# Altium schematic sheet SerialConverter.SchDoc
size A; SheetNumber: 3; SheetTotal: 6
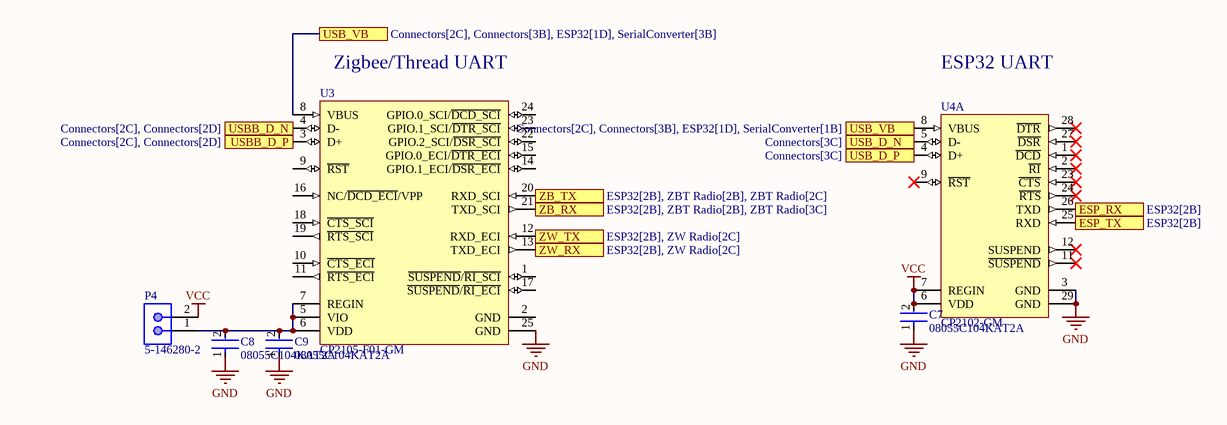
[diagram p0: SerialConverter.SchDoc]

## Parts
C7  08055C104KAT2A  [FP-0805-L_2_01_0_2-W_1_25-IPC_C]
C8  08055C104KAT2A  [FP-0805-L_2_01_0_2-W_1_25-IPC_C]
C9  08055C104KAT2A  [FP-0805-L_2_01_0_2-W_1_25-IPC_C]
P4  5-146280-2  [TECO-5-146280-2_V]
U3  CP2105-F01-GM  [SLAB-QFN-24-2675x2675TP_N]
U4  CP2102-GM  [SLAB-QFN-28-3125x3125TP_N]  (part A of 2)

## Ports
ESP_RX (out, see ESP32[2B]), ESP_TX (in, see ESP32[2B]), USB_D_N (see Connectors[3C]), USB_D_P (see Connectors[3C]), USB_VB (see Connectors[2C], Connectors[3B], ESP32[1D], SerialConverter[1B]), USB_VB (see Connectors[2C], Connectors[3B], ESP32[1D], SerialConverter[3B]), USBB_D_N (see Connectors[2C], Connectors[2D]), USBB_D_P (see Connectors[2C], Connectors[2D]), ZB_RX (out, see ESP32[2B], ZBT Radio[2B], ZBT Radio[3C]), ZB_TX (in, see ESP32[2B], ZBT Radio[2B], ZBT Radio[2C]), ZW_RX (out, see ESP32[2B], ZW Radio[2C]), ZW_TX (in, see ESP32[2B], ZW Radio[2C])

## Nets
GND: C7.1 C8.1 C9.1 U3.25(GND) U4.3(GND) U4.29(GND)
VCC: C7.2 P4.2 U4.6(VDD) U4.7(REGIN)
ESP_RX: U4.26(TXD) ; port ESP_RX
ESP_TX: U4.25(RXD) ; port ESP_TX
USB_D_N: U4.5(D-) ; port USB_D_N
USB_D_P: U4.4(D+) ; port USB_D_P
USB_VB: U3.8(VBUS) U4.8(VBUS) ; port USB_VB
USBB_D_N: U3.4(D-) ; port USBB_D_N
USBB_D_P: U3.3(D+) ; port USBB_D_P
ZB_RX: U3.21(TXD_SCI) ; port ZB_RX
ZB_TX: U3.20(RXD_SCI) ; port ZB_TX
ZW_RX: U3.13(TXD_ECI) ; port ZW_RX
ZW_TX: U3.12(RXD_ECI) ; port ZW_TX
NetC8_2: C8.2 C9.2 P4.1 U3.5(VIO) U3.6(VDD) U3.7(REGIN)

Not connected (* = marked no-connect by the designer): U3 1(~{SUSPEND}/~{RI_SCI}) 2(GND) 9(~{RST}) 10(~{CTS_ECI}) 11(~{RTS_ECI}) 14(GPIO.1_ECI/~{DSR_ECI}) 15(GPIO.0_ECI/~{DTR_ECI}) 16(NC/~{DCD_ECI}/VPP) 17(~{SUSPEND}/~{RI_ECI}) 18(~{CTS_SCI}) 19(~{RTS_SCI}) 22(GPIO.2_SCI/~{DSR_SCI}) 23(GPIO.1_SCI/~{DTR_SCI}) 24(GPIO.0_SCI/~{DCD_SCI}); U4 1(~{DCD})* 2(~{RI})* 9(~{RST})* 11(~{SUSPEND})* 12(SUSPEND)* 23(~{CTS})* 24(~{RTS})* 27(~{DSR})* 28(~{DTR})*

## Notes on the sheet
- (near U3) Zigbee/Thread UART
- ESP32 UART

## Library data of the parts
C7-C9 = CMP-2000-05016-2: General Purpose Ceramic Capacitor, 0805, 100nF, 10%, X7R, 0.15, 50V; Dissipation Factor: 2.5%; Insulation Resistance: 100GR; Voltage Rating (DC): 50V; Package Quantity: 4000; Tolerance: 10%; Voltage Rating: 50V; Dielectric: X7R; Case/Package: 0805; Lead Free: Lead Free; Dielectric Material: Ceramic; Thickness: 0.037inch; Weight: 0.001411oz; Max Operating Temperature: 125°C; REACH SVHC: No SVHC; Mount: Surface Mount; RoHS Compliant: Yes; Depth: 1.25mm; Height: 0.5mm; Case Code (Metric): 2012; Length: 2mm; Termination: Standard; Case Code (Imperial): 0805; Number of Pins: 2; Voltage: 50V; Radiation Hardening: No; Min Operating Temperature: -55°C; Capacitance: 100nF; Width: 1.2mm; Series: MLCC X7R; Packaging: Cut Tape
P4 = CMP-2000-07492-1: Male Header, Pitch 2.54 mm, 1 x 2 Position, Height 8.21 mm, Tail Length 3.05 mm, -65 to 105 degC, RoHS, Bulk; Manufacturer: TE Connectivity; Mating Connector Lock: No(Without); Number of Positions: 2; Pitch: 2.54mm; PCB Mounting Orientation: Vertical; Keyed: No; Case\/Package: 100; Mating Post Length: 0.23inch; High Temperature Housing: Yes; Max Current Rating: 5A; PCB Thickness: 0.063inch; PCB Mount Retention: Without; Approvals: CSA; Current Rating: 3A; Radiation Hardening: No; Length: 4.67mm; Contact Mating Length: 0.23inch; Connector Type: Header; Number of Rows: 1; Termination Post Length: 0.12inch; Board Standoff: No(Without); Max Operating Temperature: 105degC; Contact Shape: Square; Selectively Loaded: No(Without); Gasket: No(Without); Number of Contacts: 2; Contact Gender: Male; Mating Alignment: No(Without); Manufacturer URL: http://www.te.com/; Datasheet URL: http://www.te.com/commerce/DocumentDelivery/DDEController?Action=showdoc&DocId=Customer+Drawing%7F146280%7FH1%7Fpdf%7FEnglish%7FENG_CD_146280_H1.pdf%7F5-146280-2; Mount: ThroughHole; Orientation: Straight; Packaging: Carton; Package Reference: 5-146280-2; Package Quantity: 500; Stabilizers: No(Without); Row Spacing: 2.54mm; Contact Material: CopperAlloy; Panel Mount Retention: No(Without); Datasheet Version: Rev. H1, 08/2016; Housing Colour: Black; Colour: Black; Package Description: Male Header, Pitch 2.54 mm, 1 x 2 Position, Height 8.21 mm, Tail Length 3.05 mm; Contact Plating: Matte; Housing Material: Polymer; Contact Protection: No(Without); Min Operating Temperature: -65degC; Mounting Technology: ThroughHole; Flammability Rating: UL94V-0; RoHSCompliant: true; Termination: ThroughHole; Depth: 2.34mm; High Speed Serial Data Connector: No
U3 = CMP-0511-00003-1: Single-Chip USB to Dual UART Bridge, 5 Dig I/O Pins, Internal Oscillator, 296 Bytes EEPROM, -40 to 85 degC, 24-pin QFN; Manufacturer: Silicon Labs; Internal Oscillator: TRUE; Sub-Family: USB Bridges; ComponentLink3URL: http://www.silabs.com/Support%20Documents/TechnicalDocs/C8051F93x-92x.pdf; PartNumber: CP2105-F01-GM; PackageDescription: 24-Pin Quad-Flat No-Leads Package, Body 4 x 4 mm, Pitch 0.5 mm; Code_JEDEC: MO-220; ComponentLink2URL: http://www.silabs.com/Support%20Documents/TechnicalDocs/CP2105.pdf; Mounting Technology: Surface Mount; ComponentLink1URL: http://www.silabs.com/; ComponentLink1Description: Manufacturer URL; EEPROM: 296 Bytes; ComponentLink2Description: Datasheet; ComponentLink3Description: Package Specification; Code_IPC: J-STD-020; DatasheetVersion: Rev. 1.0; PackageReference: QFN-24
U4 = CMP-0511-00012-1: Single-Chip USB to UART Bridge, 1024 Bytes EEPROM, -40 to 85 degC, 28-pin QFN, Tube; Manufacturer: Silicon Labs; Internal Oscillator: TRUE; Sub-Family: USB Bridges; ComponentLink3Description: Package Specification; PackageDescription: 28-Pin Quad-Flat No-Leads Package, Body 5 x 5 mm, Pitch 0.5 mm; PartNumber: CP2102-GM; EEPROM: 1024 Bytes; Mounting Technology: Surface Mount; ComponentLink2URL: http://www.silabs.com/Support%20Documents/TechnicalDocs/CP2102-9.pdf; DatasheetVersion: Rev. 1.5; ComponentLink1URL: http://www.silabs.com/; ComponentLink2Description: Datasheet; Code_JEDEC: MO-220; PackageReference: QFN-28; Code_IPC: J-STD-020C; ComponentLink3URL: http://www.silabs.com/Support%20Documents/TechnicalDocs/C8051T61x.pdf; ComponentLink1Description: Manufacturer URL